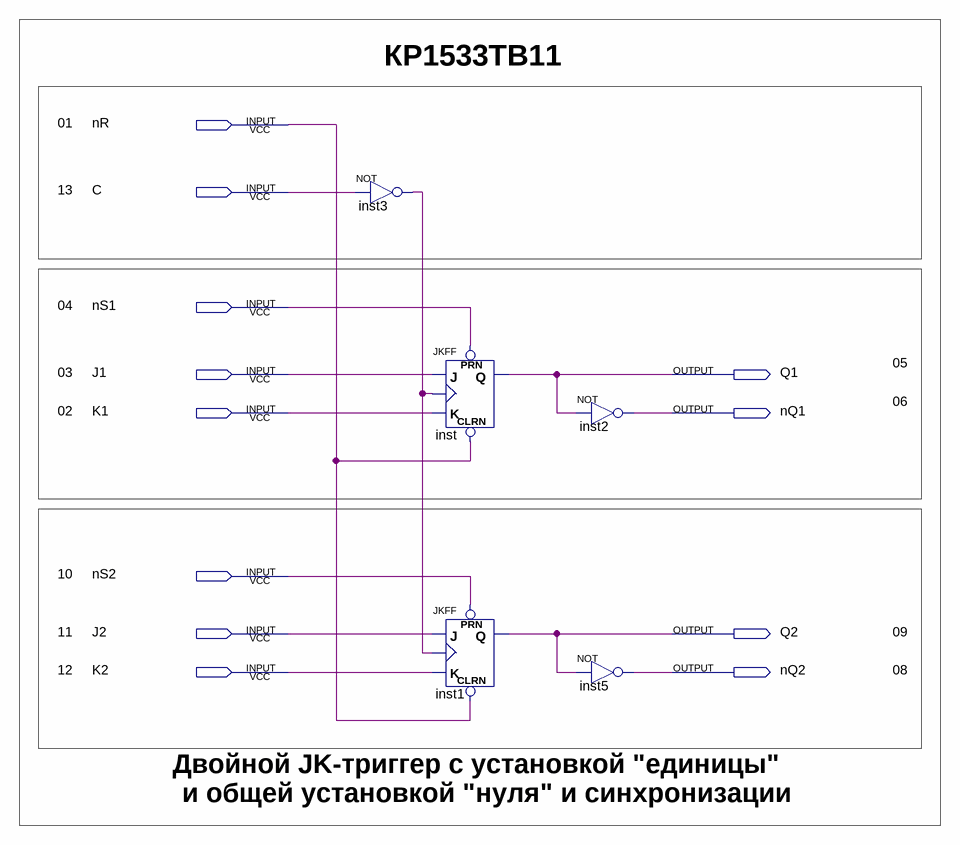
[diagram p0: schematic sheet]
// Quartus schematic KP1533TB11.bdf as structural Verilog: 5 symbols, 12 pins
module KP1533TB11 (
  input  nR,
  input  C,
  input  nS1,
  input  J1,
  input  K1,
  input  nS2,
  input  J2,
  input  K2,
  output Q1,
  output nQ1,
  output Q2,
  output nQ2
);

  wire inst3_out;

  not inst3 (inst3_out, C);
  JKFF inst (.PRN(nS1), .CLRN(nR), .K(K1), .J(J1), .CLK(inst3_out), .Q(Q1));
  JKFF inst1 (.PRN(nS2), .CLRN(nR), .K(K2), .J(J2), .CLK(inst3_out), .Q(Q2));
  not inst2 (nQ1, Q1);
  not inst5 (nQ2, Q2);

  // Notes on the sheet:
  //   КР1533ТВ11
  //   01
  //   13
  //   04
  //   05
  //   03
  //   06
  //   02
  //   10
  //   11
  //   09
  //   12
  //   08
  //   Двойной JK-триггер с установкой "единицы"
  //   и общей установкой "нуля" и синхронизации
endmodule
